# EAGLE design motherboard (EAGLE 9.6.0)
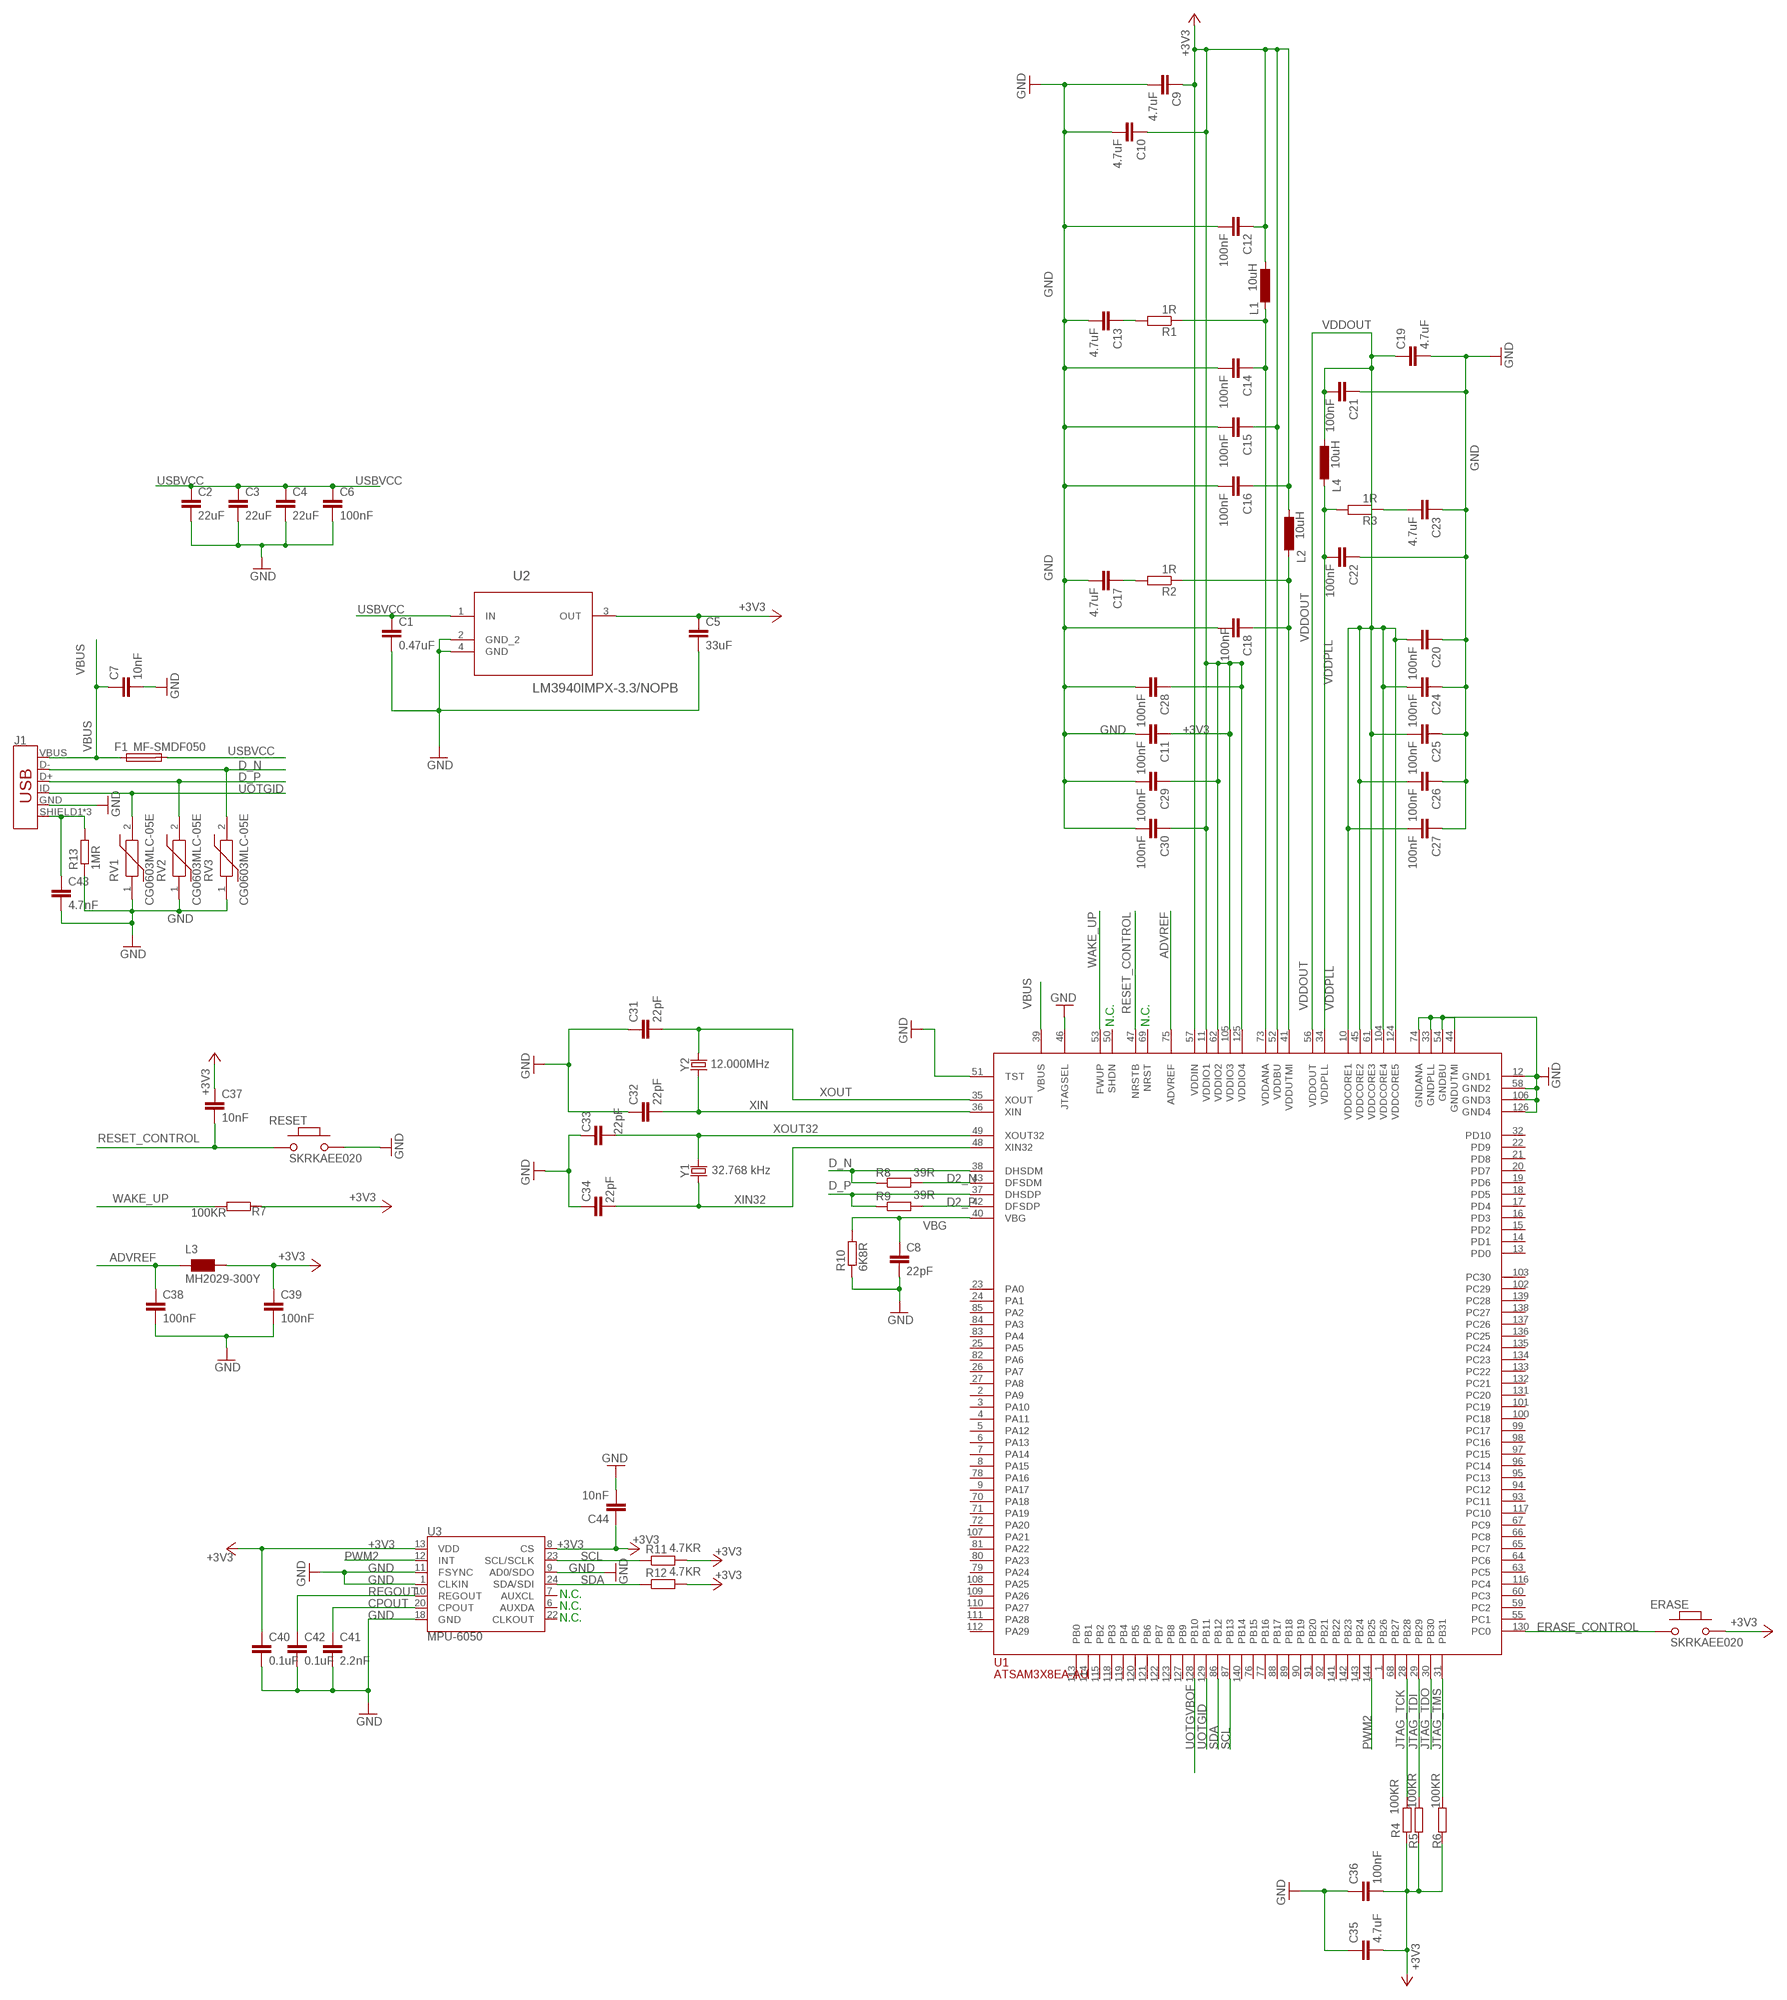
[diagram p0: schematic, sheet 1]

## Parts
C1  0.47uF  C-EUC0805  [C0805]
C2  22uF  C-EUC1206  [C1206]
C3  22uF  C-EUC1206  [C1206]
C4  22uF  C-EUC1206  [C1206]
C5  33uF  C-EUC1206  [C1206]
C6  100nF  C-EUC0402  [C0402]
C7  10nF  C-EUC0402  [C0402]
C8  22pF  C-EUC0402  [C0402]
C9  4.7uF  C-EUC0805  [C0805]
C10  4.7uF  C-EUC0805  [C0805]
C11  100nF  C-EUC0402  [C0402]
C12  100nF  C-EUC0402  [C0402]
C13  4.7uF  C-EUC0805  [C0805]
C14  100nF  C-EUC0402  [C0402]
C15  100nF  C-EUC0402  [C0402]
C16  100nF  C-EUC0402  [C0402]
C17  4.7uF  C-EUC0805  [C0805]
C18  100nF  C-EUC0201  [C0201]
C19  4.7uF  C-EUC0805  [C0805]
C20  100nF  C-EUC0402  [C0402]
C21  100nF  C-EUC0402  [C0402]
C22  100nF  C-EUC0402  [C0402]
C23  4.7uF  C-EUC0805  [C0805]
C24  100nF  C-EUC0402  [C0402]
C25  100nF  C-EUC0402  [C0402]
C26  100nF  C-EUC0402  [C0402]
C27  100nF  C-EUC0402  [C0402]
C28  100nF  C-EUC0402  [C0402]
C29  100nF  C-EUC0402  [C0402]
C30  100nF  C-EUC0402  [C0402]
C31  22pF  C-EUC0402  [C0402]
C32  22pF  C-EUC0402  [C0402]
C33  22pF  C-EUC0402  [C0402]
C34  22pF  C-EUC0402  [C0402]
C35  4.7uF  C-EUC0805  [C0805]
C36  100nF  C-EUC0402  [C0402]
C37  10nF  C-EUC0402  [C0402]
C38  100nF  C-EUC0402  [C0402]
C39  100nF  C-EUC0402  [C0402]
C40  0.1uF  C-EUC0402  [C0402]
C41  2.2nF  C-EUC0402  [C0402]
C42  0.1uF  C-EUC0402  [C0402]
C43  4.7nF  C-EUC0402  [C0402]
C44  10nF  C-EUC0402  [C0402]
ERASE  SKRKAEE020  [SOD4829X200]
F1  MF-SMDF050  [MF-SMDF050]
J1  USB_MICRO-B_FEMALE-SMT  [USB-B-MICRO-SMD]
L1  10uH  L-EUL2012C  [L2012C]
L2  10uH  L-EUL2012C  [L2012C]
L3  MH2029-300Y  [2012-EU]
L4  10uH  L-EUL2012C  [L2012C]
R1  1R  R-EU_R0402  [R0402]
R2  1R  R-EU_R0402  [R0402]
R3  1R  R-EU_R0402  [R0402]
R4  100KR  R-EU_R0603  [R0603]
R5  100KR  R-EU_R0603  [R0603]
R6  100KR  R-EU_R0603  [R0603]
R7  100KR  R-EU_R0603  [R0603]
R8  39R  R-EU_R0402  [R0402]
R9  39R  R-EU_R0402  [R0402]
R10  6K8R  R-EU_R2012  [R2012]
R11  4.7KR  R-EU_R0805  [R0805]
R12  4.7KR  R-EU_R0805  [R0805]
R13  1MR  R-EU_R1206  [R1206]
RESET  SKRKAEE020  [SOD4829X200]
RV1  CG0603MLC-05E  [VARC1608X55N]
RV2  CG0603MLC-05E  [VARC1608X55N]
RV3  CG0603MLC-05E  [VARC1608X55N]
U1  ATSAM3X8EA-AU  ATSAM3X8EA-AUAU  [LQFP144]
U2  LM3940IMPX-3.3/NOPB  [SOT230P696X180-4N]
U3  MPU-6050  MPU-6000  [QFN-24-EP]
Y1  32.768 kHz  CRYSTALSMD-3.2X1.5  [CRYSTAL-SMD-3.2X1.5MM]
Y2  12.000MHz  CRYSTALSMD-3.2X2.5  [CRYSTAL-SMD-3.2X2.5MM]

## Nets
+3V3 [POWER]: C5.1 C9.1 C10.1 C11.1 C12.1 C15.1 C16.1 C28.1 C29.1 C30.1 C35.2 C36.2 C37.1 C39.1 C40.1 C44.1 ERASE.2 L1.1 L2.1 L3.2 R4.1 R5.1 R6.1 R7.1 R11.2 R12.2 U1.11(VDDIO1) U1.52(VDDBU) U1.57(VDDIN) U1.62(VDDIO2) U1.105(VDDIO3) U1.125(VDDIO4) U2.3(OUT) U3.8(CS) U3.13(VDD)
ADVREF [POWER]: C38.1 L3.1 U1.75(ADVREF)
CPOUT [POWER]: C41.1 U3.20(CPOUT)
D2_N [DATA]: R8.2 U1.43(DFSDM)
D2_P [DATA]: R9.2 U1.42(DFSDP)
D_N [DATA]: J1.D- R8.1 RV3.2 U1.38(DHSDM)
D_P [DATA]: J1.D+ R9.1 RV2.2 U1.37(DHSDP)
ERASE_CONTROL: ERASE.1 U1.130(PC0)
GND [GND]: C1.2 C2.2 C3.2 C4.2 C5.2 C6.2 C7.2 C8.2 C9.2 C10.2 C11.2 C12.2 C13.2 C14.2 C15.2 C16.2 C17.2 C18.2 C19.2 C20.1 C21.1 C22.1 C23.1 C24.1 C25.1 C26.1 C27.1 C28.2 C29.2 C30.2 C31.1 C32.1 C33.1 C34.1 C35.1 C36.1 C38.2 C39.2 C40.2 C41.2 C42.2 C43.2 C44.2 J1.GND R10.1 R13.1 RESET.2 RV1.1 RV2.1 RV3.1 U1.12(GND1) U1.33(GNDPLL) U1.44(GNDUTMI) U1.46(JTAGSEL) U1.51(TST) U1.54(GNDBU) U1.58(GND2) U1.74(GNDANA) U1.106(GND3) U1.126(GND4) U2.2(GND_2) U2.4(GND) U3.1(CLKIN) U3.9(AD0/SDO) U3.11(FSYNC) U3.18(GND)
JTAG_TCK: R4.2 U1.28(PB28)
JTAG_TDI: R5.2 U1.29(PB29)
JTAG_TDO: U1.30(PB30)
JTAG_TMS: R6.2 U1.31(PB31)
N$1: C43.1 J1.SHIELD1(SHIELD) J1.SHIELD2(SHIELD) J1.SHIELD3(SHIELD) R13.2
N$2 [POWER]: C13.1 R1.2
N$3 [POWER]: C17.1 R2.2
N$5 [POWER]: C23.2 R3.1
N$6 [POWER]: C14.1 L1.2 R1.1 U1.73(VDDANA)
N$7 [POWER]: C18.1 L2.2 R2.1 U1.41(VDDUTMI)
PWM2 [DATA]: U1.144(PB25) U3.12(INT)
REGOUT [POWER]: C42.1 U3.10(REGOUT)
RESET_CONTROL: C37.2 RESET.1 U1.47(NRSTB)
SCL: R11.1 U1.87(PB13) U3.23(SCL/SCLK)
SDA: R12.1 U1.86(PB12) U3.24(SDA/SDI)
UOTGID: J1.ID RV1.2 U1.129(PB11)
UOTGVBOF: U1.128(PB10)
USBVCC [VCC]: C1.1 C2.1 C3.1 C4.1 C6.1 F1.2 U2.1(IN)
VBG: C8.1 R10.2 U1.40(VBG)
VBUS: C7.1 F1.1 J1.VBUS U1.39(VBUS)
VDDOUT [POWER]: C19.1 C20.2 C21.2 C24.2 C25.2 C26.2 C27.2 L4.1 U1.10(VDDCORE1) U1.45(VDDCORE2) U1.56(VDDOUT) U1.61(VDDCORE3) U1.104(VDDCORE4) U1.124(VDDCORE5)
VDDPLL [POWER]: C22.2 L4.2 R3.2 U1.34(VDDPLL)
WAKE_UP: R7.2 U1.53(FWUP)
XIN [CLK]: C32.2 U1.36(XIN) Y2.1
XIN32 [CLK]: C34.2 U1.48(XIN32) Y1.P$1
XOUT [CLK]: C31.2 U1.35(XOUT) Y2.3
XOUT32 [CLK]: C33.2 U1.49(XOUT32) Y1.P$2
Unconnected: U1.1(PB26) U1.2(PA9) U1.3(PA10) U1.4(PA11) U1.5(PA12) U1.6(PA13) U1.7(PA14) U1.8(PA15) U1.9(PA17) U1.13(PD0) U1.14(PD1) U1.15(PD2) U1.16(PD3) U1.17(PD4) U1.18(PD5) U1.19(PD6) U1.20(PD7) U1.21(PD8) U1.22(PD9) U1.23(PA0) U1.24(PA1) U1.25(PA5) U1.26(PA7) U1.27(PA8) U1.32(PD10) U1.50(SHDN) U1.55(PC1) U1.59(PC2) U1.60(PC3) U1.63(PC5) U1.64(PC6) U1.65(PC7) U1.66(PC8) U1.67(PC9) U1.68(PB27) U1.69(NRST) U1.70(PA18) U1.71(PA19) U1.72(PA20) U1.76(PB15) U1.77(PB16) U1.78(PA16) U1.79(PA24) U1.80(PA23) U1.81(PA22) U1.82(PA6) U1.83(PA4) U1.84(PA3) U1.85(PA2) U1.88(PB17) U1.89(PB18) U1.90(PB19) U1.91(PB20) U1.92(PB21) U1.93(PC11) U1.94(PC12) U1.95(PC13) U1.96(PC14) U1.97(PC15) U1.98(PC16) U1.99(PC17) U1.100(PC18) U1.101(PC19) U1.102(PC29) U1.103(PC30) U1.107(PA21) U1.108(PA25) U1.109(PA26) U1.110(PA27) U1.111(PA28) U1.112(PA29) U1.113(PB0) U1.114(PB1) U1.115(PB2) U1.116(PC4) U1.117(PC10) U1.118(PB3) U1.119(PB4) U1.120(PB5) U1.121(PB6) U1.122(PB7) U1.123(PB8) U1.127(PB9) U1.131(PC20) U1.132(PC21) U1.133(PC22) U1.134(PC23) U1.135(PC24) U1.136(PC25) U1.137(PC26) U1.138(PC27) U1.139(PC28) U1.140(PB14) U1.141(PB22) U1.142(PB23) U1.143(PB24) U3.6(AUXDA) U3.7(AUXCL) U3.22(CLKOUT)

## Notes on the sheet
- N.C. | N.C.
- N.C.
- N.C.
- N.C.

## Library data of the parts
C1-C44 = rcl:C-EU: CAPACITOR, European symbol; SPICEPREFIX: C
ERASE RESET = Zankyo_SAM:SKRKAEE020
F1 = fuse:MF-SMDF: MF-SMDF Series - PRC Resettable Fuses Source: http://www.farnell.com/datasheets/716597.pdf
J1 = SparkFun-Connectors:USB_MICRO-B: USB Type Micro-B Connector Male/female and PTH/SMT variants SparkFun Products: SparkFun microB USB Breakout <https://www.sparkfun.com/products/12035> SparkFun USB microB Plug Breakout <https://www.sparkfun.com/products/10031> SparkFun ESP8266 Thing <https://www.sparkfun.com/products/13231>; PROD_ID: CONN-11752
L1 L2 L4 = rcl:L-EU: INDUCTOR, European symbol; SPICEPREFIX: L
L3 = MH2029-300Y:MH2029-300Y: BLM21; MONTHLY_USAGE: _____; PART_NUMBER: BLM21PG300SN1D_/_MH2029-300Y; PRICE: _____; SUPPLIER: _____
R1-R13 = rcl:R-EU_: RESISTOR, European symbol; SPICEPREFIX: R
RV1-RV3 = CG0603MLC-05E:CG0603MLC-05E: Varistor, ESD Protector, 5VDC,20V,0603 Bourns MLC Series Power Varistor 0.5pF 20V 0603 Case Source: Datasheet <http://www.farnell.com/datasheets/1785244.pdf>; ALLIED_NUMBER: 70153503; ALLIED_PRICE-STOCK: https://www.alliedelec.com/bourns-cg0603mlc-05e/70153503/; DESCRIPTION: Varistor, ESD Protector, 5VDC,20V,0603 Bourns MLC Series Power Varistor 0.5pF 20V 0603 Case; HEIGHT: 0.55mm; MANUFACTURER_NAME: Bourns; MANUFACTURER_PART_NUMBER: CG0603MLC-05E; MOUSER_PART_NUMBER: 652-CG0603MLC-05E; MOUSER_PRICE-STOCK: https://www.mouser.com/Search/Refine.aspx?Keyword=652-CG0603MLC-05E; RS_PART_NUMBER: 8518256; RS_PRICE-STOCK: http://uk.rs-online.com/web/p/products/8518256
U1 = zankyo:ATSAM3X8EA-AU: AT91SAM ARM-based Flash MCU ATSAM3X8EA-AU; CASE: LQFP144; PART_NUMBER: ATSAM3X8EA-AU; TYPE: Circuito_Integrato
U2 = LM3940IMPX-3.3_NOPB:LM3940IMPX-3.3/NOPB: Low Dropout Regulator; AVAILABILITY: Unavailable; DESCRIPTION: 1A Low Dropout egulator for 5V to 3.3V Conversion 4-SOT-223 -40 to 125; MF: Texas Instruments; MP: LM3940IMPX-3.3/NOPB; PACKAGE: SOT-223-4 Texas Instruments; PRICE: None
U3 = SparkFun-Sensors:MPU-6000: Invensense MPU-6000 6-Axis Gryoscope/Accelerometer 3-axis gyroscope, 3-axis accelerometer in a 4x4 package. The MPU-6000 is the world’s first 6-axis I²C MotionTracking device designed for the low power, low cost, and high performance requirements of smartphones, tablets and wearable sensors. Datasheet <http://cdn.sparkfun.com/datasheets/Components/General%20IC/PS-MPU-6000A.pdf> SparkFun Products MPU-6000 - Motion Processing Unit <https://www.sparkfun.com/products/11234> (SEN-11234) SparkFun UDB5 - PIC UAV Development Board <https://www.sparkfun.com/products/11703> (GPS-11703); PROD_ID: IC-11089; SF_ID: SEN-11234
Y1 Y2 = SparkFun-Clocks:CRYSTAL: Crystals (Generic) These are passive quartz crystals, which can be used as a clock source for a microcontroller. Crystal's are two-terminal devices. They require external "load" capacitors to generate an oscillating signal.

## Net classes
0 default: width 0.203 mm, drill 0.406 mm, clearance 0.279 mm
1 POWER: width 0.254 mm, drill 0.406 mm, clearance 0.279 mm to class 0, clearance 0.279 mm
2 DATA: width 0.254 mm, drill 0.406 mm, clearance 0.61 mm to class 0, clearance 0.762 mm to class 1, clearance 0.381 mm
3 CLK: width 0.254 mm, drill 0.406 mm, clearance 0.762 mm to class 0, clearance 0.889 mm to class 1, clearance 1.143 mm to class 2, clearance 0.356 mm
4 VCC: width 0.254 mm, drill 0.406 mm, clearance 1.219 mm to class 0, clearance 1.219 mm to class 1, clearance 1.143 mm to class 2, clearance 1.219 mm to class 3, clearance 1.219 mm
5 GND: width 0.203 mm, drill 0.406 mm, clearance 0.203 mm to class 0, clearance 0.279 mm to class 1, clearance 0.61 mm to class 2, clearance 0.457 mm to class 3, clearance 0.305 mm to class 4

## Board
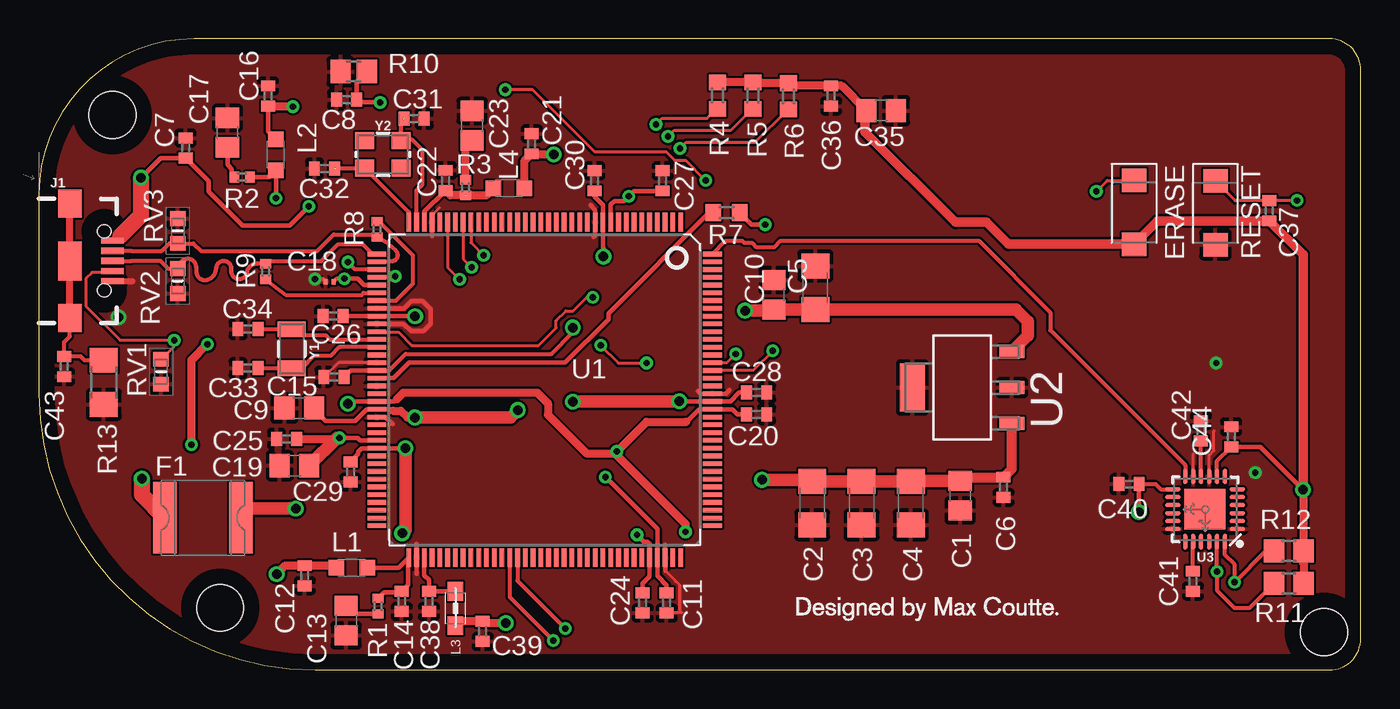
[diagram p1: board, top side]
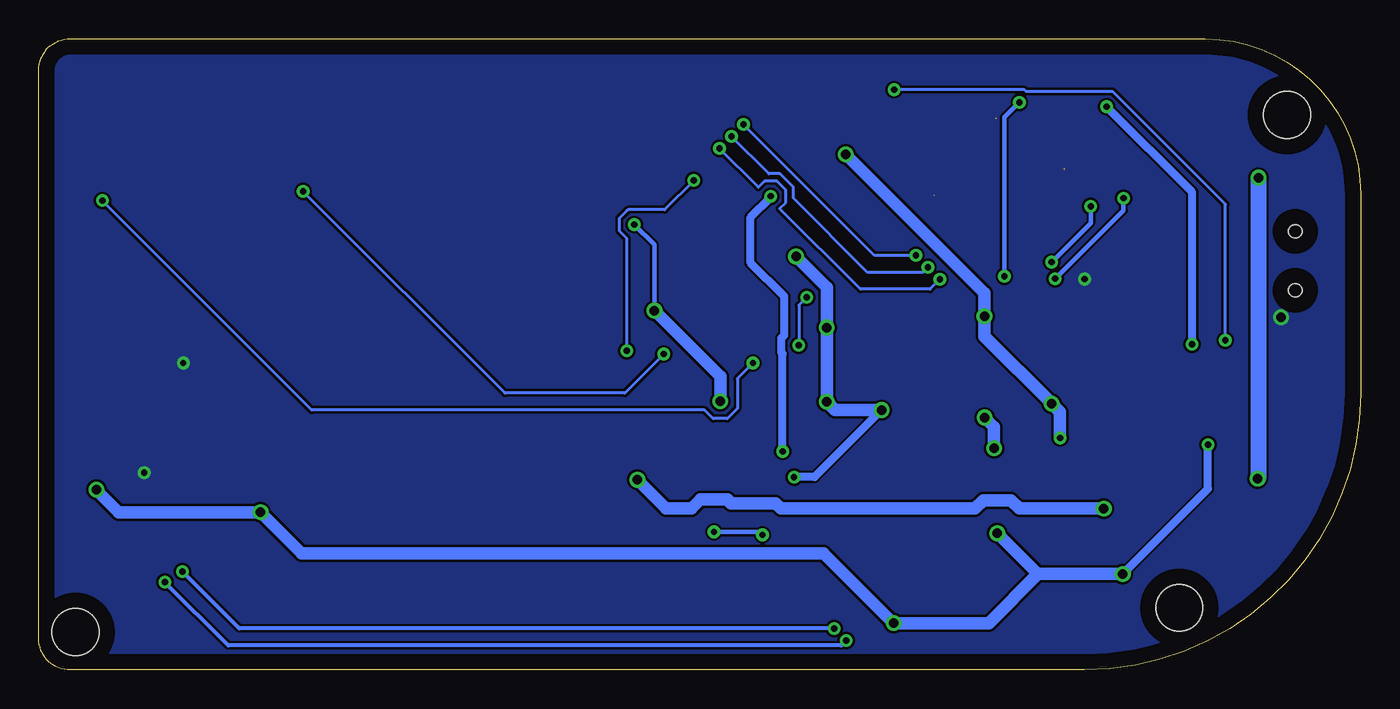
[diagram p2: board, bottom side, seen from below]

Size 85.09 x 40.64 mm. Coordinates in mm from the lower left corner, seen from the top.
Outline: 0,30.64 0,17.78 arc90 17.78,0 83.09,0 arc90 85.09,2 85.09,38.64 arc90 83.09,40.64 10,40.64 arc90 0,30.64
Copper layers (1*16): Top 0.035mm / dielectric 1.5mm / Bottom 0.035mm
Design rules "default": minimum track width 6mil, minimum drill 0.35mm, track to track 6mil, track to pad 6mil, pad to pad 6mil, via to via 6mil, smd to smd 6mil, copper to edge 40mil, drill to drill 6mil, minimum pad ring 10mil, minimum via ring 8mil, stop-mask expansion 4mil, vias tented up to drill 0mil, thermal gap 10mil
Holes 3 mm at 4.74,35.74 82.73,2.44 11.68,4

### Footprints (pad centres in the part's own frame; a part is rotated, then mirrored left to right if it is on the bottom)
C0805 = smd 1.3 x 1.5: 1 -0.95,0; 2 0.95,0
C1206 = smd 1.6 x 1.8: 1 -1.4,0; 2 1.4,0
C0402 = smd 0.7 x 0.9: 1 -0.65,0; 2 0.65,0
C0201 = smd 0.25 x 0.35: 1 -0.25,0; 2 0.25,0
SOD4829X200 = smd 1.512 x 1.572: 1 -2.05,0; 2 2.05,0
MF-SMDF050 = smd 1.5 x 4.6: 1 -2.45,0; 2 2.45,0
USB-B-MICRO-SMD = smd 1.45 x 0.4: D+ 2.725,0; D- 2.725,0.65; GND 2.725,-1.3; ID 2.725,-0.65; VBUS 2.725,1.3 | smd 1.5 x 1.8: SHIELD1 0,3.685; SHIELD2 0,-3.685 | smd 1.5 x 2.5: SHIELD3 0,0 | hole 0.85: 2.2,1.9; 2.2,-1.9
L2012C = smd 1 x 1: 1 -1,0; 2 1,0
2012-EU = smd 1.2 x 1: 1 -1.1,0; 2 1.1,0
R0402 = smd 0.6 x 0.7: 1 -0.5,0; 2 0.5,0
R0603 = smd 1 x 1.1: 1 -0.85,0; 2 0.85,0
R2012 = smd 1.3 x 1.5: 1 -0.85,0; 2 0.85,0
R0805 = smd 1.3 x 1.5: 1 -0.95,0; 2 0.95,0
R1206 = smd 1.6 x 1.803: 1 -1.422,0; 2 1.422,0
VARC1608X55N = smd 0.95 x 1: 1 -0.8,0; 2 0.8,0
LQFP144 = smd 0.3 x 1.2: 1 -8.75,-10.8; 2 -8.25,-10.8; 3 -7.75,-10.8; 4 -7.25,-10.8; 5 -6.75,-10.8; 6 -6.25,-10.8; 7 -5.75,-10.8; 8 -5.25,-10.8; 9 -4.75,-10.8; 10 -4.25,-10.8; 11 -3.75,-10.8; 12 -3.25,-10.8; 13 -2.75,-10.8; 14 -2.25,-10.8; 15 -1.75,-10.8; 16 -1.25,-10.8; 17 -0.75,-10.8; 18 -0.25,-10.8; 19 0.25,-10.8; 20 0.75,-10.8; 21 1.25,-10.8; 22 1.75,-10.8; 23 2.25,-10.8; 24 2.75,-10.8; 25 3.25,-10.8; 26 3.75,-10.8; 27 4.25,-10.8; 28 4.75,-10.8; 29 5.25,-10.8; 30 5.75,-10.8; 31 6.25,-10.8; 32 6.75,-10.8; 33 7.25,-10.8; 34 7.75,-10.8; 35 8.25,-10.8; 36 8.75,-10.8; 73 8.75,10.8; 74 8.25,10.8; 75 7.75,10.8; 76 7.25,10.8; 77 6.75,10.8; 78 6.25,10.8; 79 5.75,10.8; 80 5.25,10.8; 81 4.75,10.8; 82 4.25,10.8; 83 3.75,10.8; 84 3.25,10.8; 85 2.75,10.8; 86 2.25,10.8; 87 1.75,10.8; 88 1.25,10.8; 89 0.75,10.8; 90 0.25,10.8; 91 -0.25,10.8; 92 -0.75,10.8; 93 -1.25,10.8; 94 -1.75,10.8; 95 -2.25,10.8; 96 -2.75,10.8; 97 -3.25,10.8; 98 -3.75,10.8; 99 -4.25,10.8; 100 -4.75,10.8; 101 -5.25,10.8; 102 -5.75,10.8; 103 -6.25,10.8; 104 -6.75,10.8; 105 -7.25,10.8; 106 -7.75,10.8; 107 -8.25,10.8; 108 -8.75,10.8 | smd 1.2 x 0.3: 37 10.8,-8.75; 38 10.8,-8.25; 39 10.8,-7.75; 40 10.8,-7.25; 41 10.8,-6.75; 42 10.8,-6.25; 43 10.8,-5.75; 44 10.8,-5.25; 45 10.8,-4.75; 46 10.8,-4.25; 47 10.8,-3.75; 48 10.8,-3.25; 49 10.8,-2.75; 50 10.8,-2.25; 51 10.8,-1.75; 52 10.8,-1.25; 53 10.8,-0.75; 54 10.8,-0.25; 55 10.8,0.25; 56 10.8,0.75; 57 10.8,1.25; 58 10.8,1.75; 59 10.8,2.25; 60 10.8,2.75; 61 10.8,3.25; 62 10.8,3.75; 63 10.8,4.25; 64 10.8,4.75; 65 10.8,5.25; 66 10.8,5.75; 67 10.8,6.25; 68 10.8,6.75; 69 10.8,7.25; 70 10.8,7.75; 71 10.8,8.25; 72 10.8,8.75; 109 -10.8,8.75; 110 -10.8,8.25; 111 -10.8,7.75; 112 -10.8,7.25; 113 -10.8,6.75; 114 -10.8,6.25; 115 -10.8,5.75; 116 -10.8,5.25; 117 -10.8,4.75; 118 -10.8,4.25; 119 -10.8,3.75; 120 -10.8,3.25; 121 -10.8,2.75; 122 -10.8,2.25; 123 -10.8,1.75; 124 -10.8,1.25; 125 -10.8,0.75; 126 -10.8,0.25; 127 -10.8,-0.25; 128 -10.8,-0.75; 129 -10.8,-1.25; 130 -10.8,-1.75; 131 -10.8,-2.25; 132 -10.8,-2.75; 133 -10.8,-3.25; 134 -10.8,-3.75; 135 -10.8,-4.25; 136 -10.8,-4.75; 137 -10.8,-5.25; 138 -10.8,-5.75; 139 -10.8,-6.25; 140 -10.8,-6.75; 141 -10.8,-7.25; 142 -10.8,-7.75; 143 -10.8,-8.25; 144 -10.8,-8.75
SOT230P696X180-4N = smd 1.6 x 0.838: 1 -3.2,2.311; 2 -3.2,0; 3 -3.2,-2.311 | smd 1.6 x 3.099: 4 3.2,0
QFN-24-EP = smd 1.016 x 0.254: 1 -2.066,1.257; 2 -2.066,0.75; 3 -2.066,0.247; 4 -2.066,-0.287; 5 -2.066,-0.792; 6 -2.066,-1.297; 13 2.086,-1.297; 14 2.086,-0.792; 15 2.086,-0.287; 16 2.086,0.247; 17 2.086,0.75; 18 2.086,1.257 | smd 0.254 x 1.016: 7 -1.267,-2.122; 8 -0.762,-2.122; 9 -0.258,-2.122; 10 0.278,-2.122; 11 0.78,-2.122; 12 1.287,-2.122; 19 1.287,2.082; 20 0.78,2.082; 21 0.278,2.082; 22 -0.258,2.082; 23 -0.762,2.082; 24 -1.267,2.082 | smd 2.616 x 2.616: P$1 0.02,-0.01
CRYSTAL-SMD-3.2X1.5MM = smd 1 x 1.8: P$1 -1.25,0; P$2 1.25,0
CRYSTAL-SMD-3.2X2.5MM = smd 1.2 x 1.1: 1 -1.175,-0.875; 2 1.175,-0.875; 3 1.175,0.875; 4 -1.175,0.875

### Placement (x,y rotation side)
C1  59.31,11.23 270 top
C2  49.78,10.74 270 top
C3  52.96,10.74 270 top
C4  56.13,10.74 270 top
C5  49.99,24.61 90 top
C6  62.1,11.76 270 top
C7  9.45,33.6 90 top
C8  19.81,36.73 180 top
C9  16.76,16.87 180 top
C10  47.32,24.16 90 top
C11  40.41,4.32 270 top
C12  17.12,6.07 270 top
C13  19.79,3.17 270 top
C14  23.37,4.42 270 top
C15  19,18.87 180 top
C16  14.76,36.96 90 top
C17  12.14,34.59 90 top
C18  18.72,24.99 180 top
C19  16.46,13.16 180 top
C20  46.2,16.46 180 top
C21  31.72,33.88 270 top
C22  26.19,31.52 270 top
C23  27.89,35.05 270 top
C24  38.86,4.32 90 top
C25  15.95,14.88 0 top
C26  18.95,22.78 0 top
C27  40.16,31.5 270 top
C28  46.2,17.86 0 top
C29  20.07,12.75 270 top
C30  35.76,31.5 90 top
C31  24.16,35.48 180 top
C32  18.39,32.28 0 top
C33  13.46,19.43 0 top
C34  13.46,21.95 0 top
C35  54.23,36.02 180 top
C36  51,36.96 90 top
C37  79.22,29.57 90 top
C38  25.12,4.42 270 top
C39  28.57,2.49 270 top
C40  70.18,11.96 180 top
C41  74.3,5.71 270 top
C42  74.8,15.39 90 top
C43  1.63,19.53 270 top
C44  76.76,15.01 90 top
ERASE  70.51,29.46 270 top
F1  10.57,9.8 0 top
J1  2,26.34 0 top
L1  20.14,6.58 0 top
L2  15.27,33.17 270 top
L3  26.82,3.96 270 top
L4  30.25,31.01 180 top
R1  21.84,4.11 270 top
R2  13.08,31.72 180 top
R3  27.48,31.06 270 top
R4  43.69,36.98 270 top
R5  45.97,36.98 270 top
R6  48.26,36.93 270 top
R7  44.27,29.44 180 top
R8  21.77,28.37 90 top
R9  14.61,25.65 270 top
R10  20.27,38.53 0 top
R11  80.47,5.57 0 top
R12  80.47,7.67 0 top
R13  4.19,18.52 90 top
RESET  75.74,29.44 270 top
RV1  7.87,19.2 90 top
RV2  8.94,25.04 90 top
RV3  8.94,28.27 270 top
U1  32.56,18.03 180 top
U2  59.44,18.19 180 top
U3  75.08,10.34 180 top
Y1  16.28,20.68 270 top
Y2  22.15,33.2 0 top

### Tracks (layer width: path | path; a pad name or v marks a point on that pad's centre or on a via)
+3V3  (via drill 0.41, 0.61)
  Top 0.254: 17.84,16.66 17.5,16.66 C9.1 | C40.1 71.88,11.96 72.21,11.63 U3.13 | U1.52 22.56,19.28 23.62,20.34 32.99,20.34 34.37,21.72 v34.37,22.05 | U3.8 75.84,13.45 C44.1
  Top 0.279: v36.47,12.42 39.81,9.08 U1.105 39.81,6.06 40.41,5.46 C11.1 | v36.35,26.62 36.35,27.18 36.32,27.2 36.32,28.82 | U1.11 36.31,29.93 35.76,30.48 C30.1 | v41.22,17.3 43.35,17.3 U1.125 44.51,17.28 45.09,17.86 C28.1 | v23.6,14.28 21.77,14.28 | 21.77,14.28 U1.62 | C29.1 20.57,13.9 20.57,14.05 20.79,14.28 21.77,14.28 | U1.52 20.06,19.28 C15.1 | 22.71,16.78 22.81,16.69 | U1.57 21.1,16.78 20.34,16.03 18.46,16.03 17.84,16.66 | v46.76,28.68 45.88,28.68 R7.1 | L2.1 14.76,34.68 14.76,36.17 C16.1 | 70.79,12 C40.1
  Top 0.305: 36.32,28.82 U1.11 | U1.57 22.71,16.78 | v81.38,11.61 78.63,14.36 C44.1 | v70.81,10.16 70.81,11.95 C40.1
  Top 0.508: 22.81,16.69 23.29,16.69 23.72,16.26 v24.21,16.26 | v15.32,6.17 15.87,6.72 C12.1 19,6.72 L1.1 | v30.06,3.01 28.7,3.01 C39.1 27.1,3.14 L3.2 | v9.83,14.5 9.83,19.96 v10.85,20.98 | v16.36,36.27 14.86,36.27 14.76,36.17 | 81.42,6.86 R11.2 | C35.2 51.69,37.61 C36.2 48.44,37.61 R6.1 46.02,37.78 R5.1 R4.1 | 81.42,7.69 R12.2 81.44,6.84 81.42,6.86 | v81.38,11.61 81.38,6.89 81.42,6.86
  Top 0.61: v81.38,11.61 81.38,26.76 C37.1 72.01,28.92 ERASE.2 62.41,27.41 60.99,28.83 59,28.83 53.19,34.65 53.19,35.55 53.28,35.65 | 53.28,35.65 C35.2 | 53.32,35.65 53.28,35.65
  Top 0.813: C5.1 | C5.1 C10.1 47.25,23.14 v45.47,23.14 | v41.22,17.3 41.2,17.27 v34.37,17.27 | v30.84,16.74 30.35,16.26 v24.21,16.26 | U2.3 63.68,21.54 63.68,22.43 62.9,23.2 C5.1 | v23.6,14.28 23.6,9 v23.39,8.8
  Bottom 0.279: v45.47,23.14 45.47,27.38 v46.76,28.68
  Bottom 0.508: v30.84,16.74 35.15,12.42 v36.47,12.42 | v15.32,6.17 9.83,11.66 v9.83,14.5 | v10.85,20.98 10.85,30.76 v16.36,36.27
  Bottom 0.813: v41.22,17.3 41.22,18.9 v45.47,23.14 | v24.21,16.26 23.6,15.65 v23.6,14.28 | v30.84,16.74 33.83,16.74 v34.37,17.27 v34.37,22.05 34.37,24.64 v36.35,26.62 | v23.39,8.8 20.77,6.17 | v15.32,6.17 20.77,6.17 | 20.77,6.17 23.93,3.01 v30.06,3.01 34.57,7.52 68.17,7.52 v70.81,10.16 79.93,10.16 v81.38,11.61
ADVREF
  Top 0.279: U1.75 24.81,6.1 25.12,5.79 C38.1 L3.1
CPOUT
  Top 0.254: C41.1 74.3,8.25 U3.20
D2_N
  Top 0.254: U1.43 23,23.78 24.08,24.87 24.08,26.7 21.9,28.87 R8.2
D2_P
  Top 0.254: U1.42 20.91,24.28 20.75,24.13 15.93,24.13 R9.2
D_N
  Top 0.254: U1.38 22.71,26.31 arc132 22.99,27 arc21 R8.1 21.6,28.04 18.98,28.04 17.93,26.99 17.93,26.98 10.44,26.98 9.95,27.47 RV3.2 8.39,27.47 7.91,26.98 5.97,26.98 5.96,26.99 J1.D-
D_P
  Top 0.254: J1.D+ 5.96,26.34 5.97,26.35 7.82,26.35 8.32,25.84 RV2.2 9.08,25.98 arc-157 10.08,26.14 arc-23 10.16,25.65 arc121 10.95,25.15 arc59 11.4,25.86 arc-185 12.39,25.76 arc86 12.8,25.17 arc94 13.39,25.58 arc-83 14.07,26.16 R9.1 14.77,26.31 18.19,26.31 19.28,27.41 20.85,27.41 21.48,26.78 U1.37
ERASE_CONTROL  (via drill 0.41)
  Top 0.203: U1.130 44.3,19.78 v44.86,20.34 | v68.07,30.81 68.78,31.51 ERASE.1
  Bottom 0.203: v44.86,20.34 47.37,17.83 55.09,17.83 v68.07,30.81
GND  (via drill 0.41, 0.61)
  Top 0.203: U1.51 19.29,19.78 18.38,18.87 C15.2 | U1.33 25.31,29.27 25.78,29.74 | U3.11 74.3,13.89 | U3.9 75.34,13.82 75.64,14.12 75.64,15.39 | C11.2 40.43,3.68 41.4,3.68 41.24,3.84 41.24,5.48 41.02,5.7 41.01,5.7 40.34,6.38
  Top 0.254: C18.2 18.29,25.17 v17.78,25.17
  Top 0.279: U1.46 23.49,22.28 23.95,21.82 24.77,21.82 25.22,22.28 25.22,23.24 24.71,23.75 23.98,23.75 23.51,23.28 U1.44 | U1.33 25.31,27.95 | U1.58 22.3,16.28 22.76,15.82 | 24.31,8.13 U1.74 24.31,6.18 | 40.34,6.38 40.34,7.21 U1.106 40.32,7.24 40.32,8.07 | 42.44,17.96 42.62,17.78 U1.126 44.04,17.78 44.2,17.78 44.45,18.03 | 35.71,27.86 35.81,27.96 U1.12 35.81,29.62 35.51,29.92
  Top 0.381: J1.GND 6.02,25.04
  other vias: 5.13,22.71 78.31,12.7 75.79,19.76
  pour Top: 0,40.74 85.14,40.74 85.19,40.69 85.19,-0.05 85.14,-0.1 -0.05,-0.1 -0.15,0 -0.15,40.69 -0.1,40.74
  pour Bottom: -0.08,40.87 85.22,40.87 85.24,40.84 85.24,-0.18 85.19,-0.23 -0.1,-0.23 -0.28,-0.05 -0.28,40.74 -0.2,40.82 -0.15,40.87
JTAG_TCK  (via drill 0.41)
  Top 0.203: v28.63,26.7 27.81,27.51 U1.28 | v39.73,35.13 40.12,35.52 43.03,35.52 43.64,36.13 R4.2
  Bottom 0.203: v28.63,26.7 31.29,26.7 v39.73,35.13
JTAG_TDI  (via drill 0.41)
  Top 0.203: v27.85,25.92 27.31,26.46 U1.29 | v40.5,34.36 40.89,34.75 44.54,34.75 45.92,36.13 R5.2
  Bottom 0.203: v27.85,25.92 28.17,25.6 31.75,25.6 36.52,30.38 36.52,31.11 37.37,31.95 38.09,31.95 v40.5,34.36
JTAG_TMS  (via drill 0.41)
  Top 0.203: v27.08,25.15 26.31,25.92 U1.31 | v41.27,33.58 41.66,33.98 46.11,33.98 48.21,36.08 R6.2
  Bottom 0.203: v41.27,33.58 38.77,31.08 38.37,31.47 37.57,31.47 37.01,30.91 37.01,30.11 37.4,29.71 32.2,24.51 27.72,24.51 v27.08,25.15 | v27.08,25.15
N$1
  Top 0.254: R13.2 2.95,19.94 2.69,20.19 1.64,20.19 C43.1 1.63,21.11 2,21.48 J1.SHIELD2
  Top 0.457: J1.SHIELD2 J1.SHIELD3 J1.SHIELD1
N$2
  Top 0.279: R1.2 20.3,3.62 C13.1
N$3
  Top 0.279: R2.2 12.42,31.89 12.42,32.26 12.14,32.54 C17.1
N$5
  Top 0.508: R3.1 27.48,33.7 C23.2
N$6
  Top 0.279: 23.77,7.2 U1.73 | 23.77,7.2 23.77,5.48 C14.1 23.3,5 22.23,5 R1.1 | 23.77,7.2 23.16,6.58 L1.2
N$7  (via drill 0.41)
  Top 0.254: v19.66,25.2 19.17,25.2 C18.1
  Top 0.279: v15.27,30.38 L2.2 14.82,31.73 R2.1 | U1.41 20.94,24.78 20.52,25.2 v19.66,25.2
  Bottom 0.279: v19.66,25.2 15.27,29.59 v15.27,30.38
PWM2
  Top 0.254: U1.144 44.21,27.64 45.27,27.64 45.4,27.51 45.9,27.51 46.17,27.24 47.36,27.24 47.75,27.64 60.5,27.64 65.11,23.02 65.11,21.88 73.8,13.2 U3.12
REGOUT
  Top 0.254: U3.10 C42.1
  Top 0.279: C42.1
RESET_CONTROL  (via drill 0.41)
  Top 0.203: U1.47 21.79,21.76 23.15,21.76 24,20.9 32.18,20.9 33.3,22.02 33.3,22.49 33.92,23.11 34.39,23.11 35.28,24 v35.66,24 | v81,30.23 79.23,30.23 | C37.2 77.02,30.22 RESET.1 | v36.17,20.9 37.31,19.76 v39.12,19.76
  Top 0.279: 79.23,30.23 C37.2
  Bottom 0.203: v35.66,24 36.17,23.5 v36.17,20.9 | v39.12,19.76 40.12,18.76 40.12,16.84 40.77,16.19 41.68,16.19 42.23,16.74 67.51,16.74 v81,30.23
SCL  (via drill 0.41)
  Top 0.254: U1.87 30.81,5.75 v33.89,2.67 | v75.84,6.33 | v75.84,6.33 U3.23 | v75.84,6.33 75.84,5.13 76.96,4.01 77.96,4.01 R11.1
  Bottom 0.254: v33.89,2.67 72.19,2.67 v75.84,6.33
SDA  (via drill 0.41)
  Top 0.254: U1.86 30.31,4.7 v33.12,1.9 | U3.24 76.35,7.42 76.97,6.8 v76.97,5.65 78.99,7.67 R12.1
  Bottom 0.254: v33.12,1.9 | v33.12,1.9 33.44,1.58 72.9,1.58 v76.97,5.65
UOTGID  (via drill 0.41)
  Top 0.203: J1.ID 4.64,25.6 3.43,25.6 3.02,25.2 3.02,23.44 5.23,21.23 v8.71,21.23 8.71,20.84 RV1.2 | v47.24,20.55 45.98,19.28 U1.129 | v30.02,37.36 31.77,37.36 31.86,37.27 35.31,33.83 35.79,33.35 40.39,33.35 40.94,32.8 41.65,32.8 v42.93,31.52
  Bottom 0.203: v8.71,21.23 8.71,29.99 15.96,37.24 21.52,37.24 21.65,37.36 v30.02,37.36 | v42.93,31.52 44.81,29.64 47.16,29.64 47.21,29.59 47.24,29.59 47.24,29.56 47.73,29.08 47.73,28.28 47.24,27.79 v47.24,20.55
USBVCC  (via drill 0.61)
  Top 0.635: C1.1 59.54,12.41 C6.1 62.64,12.94 U2.1
  Top 0.813: F1.2 13.6,10.39 v16.54,10.39 | v46.56,12.24 49.69,12.24 C2.1 C3.1 C4.1 56.17,12.18 C1.1
  Bottom 0.813: v46.56,12.24 44.7,10.39 43.08,10.39 42.49,10.97 40.77,10.97 40.52,10.73 37.66,10.73 37.32,10.39 24.82,10.39 24.28,10.93 22.51,10.93 21.96,10.39 v16.54,10.39
VBG  (via drill 0.41)
  Top 0.279: v21.97,36.55 20.64,36.55 C8.1 20.46,37.88 R10.2 | U1.40 22.87,25.28 v22.94,25.35
  Bottom 0.279: v22.94,25.35 22.94,35.59 v21.97,36.55
VBUS  (via drill 0.41, 0.61)
  Top 0.254: U1.39 20.37,25.78 v19.89,26.26
  Top 0.279: v17.37,29.84 16.14,28.61 13.12,28.61 10.92,30.81 10.92,31.48 C7.1 7.83,32.95 v6.58,31.7
  Top 0.406: J1.VBUS 5.05,27.96
  Top 0.61: 5.05,27.96 5.26,27.96
  Top 1.016: 5.26,27.96 6.58,29.29 v6.58,31.7 | v6.63,12.32 6.63,11.29 F1.1
  Bottom 0.279: v17.37,29.84 17.37,28.78 v19.89,26.26
  Bottom 1.016: v6.63,12.32 6.58,12.37 v6.58,31.7
VDDOUT  (via drill 0.41, 0.61)
  Top 0.279: v38.51,8.7 38.95,8.26 39.19,8.26 39.31,8.13 U1.104 39.31,6.01 38.86,5.56 C24.2 | C27.2 38.31,30.85 v37.97,30.5 37.67,30.2 37.06,30.2 36.81,29.95 U1.10 | C20.2 44.98,16.46 44.66,16.78 U1.124 42.49,16.78 41.68,15.98 | v19.89,17.14 20.03,17.28 U1.56 | v19.36,14.94 20.52,14.94 20.67,14.78 U1.61 | v24.21,22.78 U1.45 C26.2
  Top 0.305: U1.56 22.9,17.28 23.04,17.42
  Top 0.508: 23.04,17.42 23.47,17.86 32.08,17.86 32.77,17.17 32.77,16.43 35.26,13.95 37.08,13.95 | v41.63,8.89 41.63,9.4 37.08,13.95 | 37.08,13.95 v37.2,14.07 39.12,15.98 41.68,15.98 | C25.2 19.14,14.88 19.19,14.94 | v33.15,33.2 31.76,33.2 C21.2 31.25,32.76 L4.1
  Top 0.813: C19.1 19.19,14.94 v19.36,14.94
  Bottom 0.279: v41.63,8.89 38.7,8.89 v38.51,8.7
  Bottom 0.508: v37.97,30.5 37.97,30.45 39.27,29.16 39.27,26.21 37.1,24.05 37.1,21.55 37.29,21.37 37.29,20.44 37.2,20.36 v37.2,14.07
  Bottom 0.813: v19.36,14.94 19.36,16.61 v19.89,17.14 24.21,21.47 v24.21,22.78 24.21,24.26 v33.15,33.2
VDDPLL  (1 unrouted)
  Top 0.279: C22.2 24.82,29.5 U1.34
  Top 0.508: L4.2 28.79,30.55 R3.2 | R3.2 26.5,30.56 C22.2
WAKE_UP
  Top 0.279: U1.53 22.85,18.78 23.85,19.79 33.88,19.79 36.66,22.57 36.66,22.96 43.14,29.44 R7.2
XIN  (1 unrouted)
  Top 0.254: U1.36 23.81,29.48 Y2.1 20.93,32.28 19.11,32.28
XIN32
  Top 0.254: C34.2 14.13,21.93 Y1.P$1 16.31,21.93 16.67,21.57 18.45,21.57 18.73,21.29 21.75,21.29 U1.48
XOUT  (1 unrouted)
  Top 0.254: Y2.3 23.32,34.14 | 23.32,34.14 23.32,35.3 23.44,35.42 23.44,35.48 | U1.35 24.31,30.89 24.69,31.27 24.69,33.48 24.03,34.14 23.32,34.14
XOUT32
  Top 0.254: C33.2 Y1.P$2 16.91,19.43 17.7,20.22 18.77,20.22 19.34,20.78 U1.49